# EAGLE design one_wire_master (EAGLE 7.2.0)
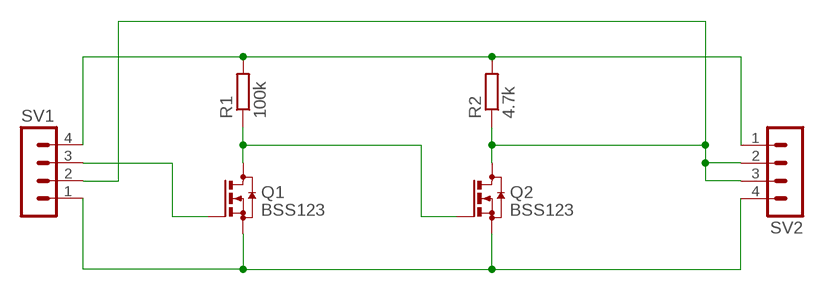
[diagram p0: schematic, sheet 1]

## Parts
Q1  BSS123  [SOT23]
Q2  BSS123  [SOT23]
R1  100k  R-EU_M0805  [M0805]
R2  4.7k  R-EU_M0805  [M0805]
SV1  MA04-1  [MA04-1]
SV2  MA04-1  [MA04-1]

## Nets
GND: Q1.2(S) Q2.2(S) SV1.1 SV2.4
IN: Q1.1(G) SV1.3
N$1: Q1.3(D) Q2.1(G) R1.1
OW: Q2.3(D) R2.1 SV1.2 SV2.2 SV2.3
VCC: R1.2 R2.2 SV1.4 SV2.1

## Library data of the parts
Q1 Q2 = transistor-small-signal:BSS123: N-CHANNEL MOS FET
R1 R2 = rcl:R-EU_: RESISTOR, European symbol
SV1 SV2 = con-lstb:MA04-1: PIN HEADER; OC_FARNELL: unknown; OC_NEWARK: unknown

## Board
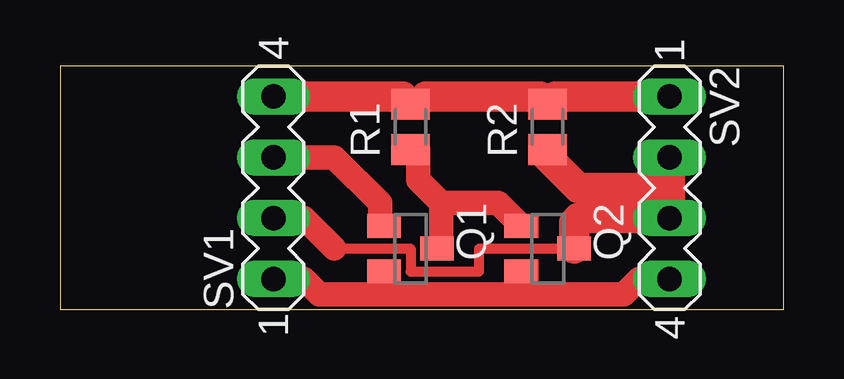
[diagram p1: board, top side]

Size 30.15 x 10.15 mm. Coordinates in mm from the lower left corner, seen from the top.
Outline: 0,0 30.15,0 30.15,10.15 0,10.15 0,0
Copper layers (1*16): Top 0.035mm / dielectric 1.5mm / Bottom 0.035mm
Design rules "default": minimum track width 10mil, minimum drill 24mil, track to track 8mil, track to pad 8mil, pad to pad 8mil, via to via 8mil, smd to smd 8mil, copper to edge 40mil, drill to drill 8mil, minimum pad ring 10mil, minimum via ring 8mil, stop-mask expansion 4mil, vias tented up to drill 0mil, thermal gap 10mil

### Footprints (pad centres in the part's own frame; a part is rotated, then mirrored left to right if it is on the bottom)
SOT23 = smd 1 x 1.4: 1 -0.95,-1.1; 2 0.95,-1.1; 3 0,1.1
M0805 = smd 1.3 x 1.6: 1 -0.95,0; 2 0.95,0
MA04-1 = drill 1.016 long: 1 -3.81,0; 2 -1.27,0; 3 1.27,0; 4 3.81,0

### Placement (x,y rotation side)
Q1  14.61,2.54 270 top
Q2  20.32,2.54 270 top
R1  14.61,7.62 90 top
R2  20.32,7.62 90 top
SV1  8.89,5.08 90 top
SV2  25.4,5.08 270 top

### Tracks (layer width: path | path; a pad name or v marks a point on that pad's centre or on a via)
GND
  Top 0.406: 13.19,1.27 Q1.2 | 19.54,1.27 Q2.2 19.05,1.42 19.05,0.64 | Q1.2 13.34,1.42 13.34,0.64 13.51,0.81 Q1.2
  Top 1.016: SV1.1 10.16,1.27 10.79,0.64 13.34,0.64 19.05,0.64 23.5,0.64 24.13,1.27 SV2.4
IN
  Top 0.406: 13.34,3.66 Q1.1
  Top 1.016: SV1.3 11.43,6.35 13.34,4.45 13.34,3.66
N$1
  Top 0.406: R1.1 14.92,6.67 | 15.88,2.71 Q1.3
  Top 1.016: 14.92,6.67 14.92,5.4 15.88,4.45 | 15.88,4.45 18.27,4.45 Q2.1 | 15.88,2.71 15.88,4.45
OW
  Top 0.406: 21.59,2.71 Q2.3 17.46,2.54 17.46,1.59 14.61,1.59 14.61,2.54 11.43,2.54 | SV1.2 10.16,3.81
  Top 1.016: 10.16,3.81 11.43,2.54
  Top 1.27: R2.1 20.32,6.35 21.59,5.08 25.4,5.08 | 25.4,5.08 SV2.2 | 25.4,5.08 SV2.3 21.59,3.81 21.42,3.64 Q2.3
VCC
  Top 0.406: 14.29,8.89 R1.2 14.92,8.57 15.24,8.89 | 20,8.89 R2.2 20.64,8.89
  Top 1.27: SV1.4 14.29,8.89 | 15.24,8.89 20,8.89 | SV2.1 20.64,8.89